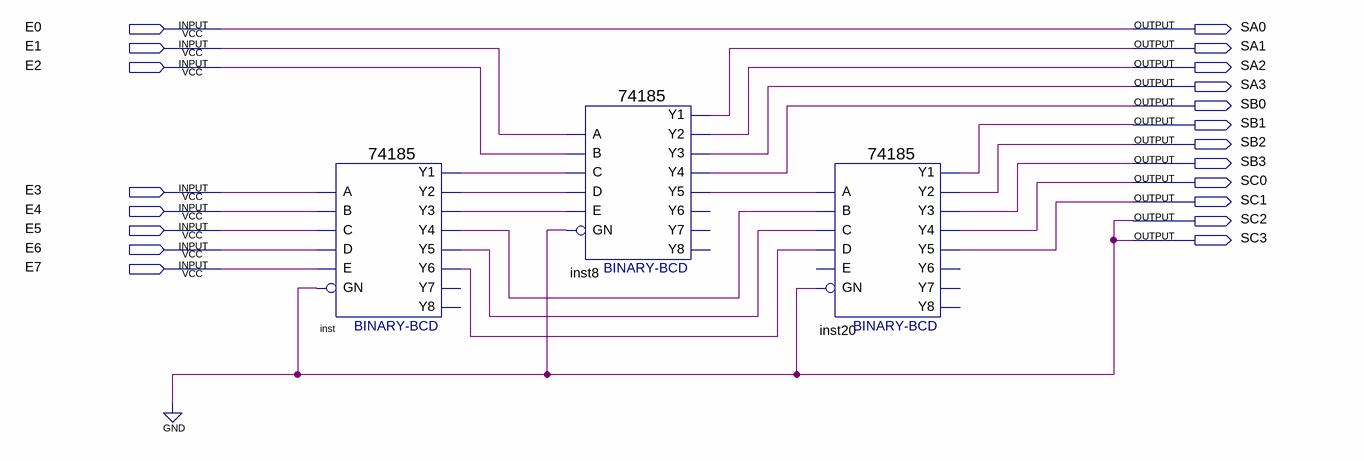
[diagram p0: schematic sheet]
// Quartus schematic figura2.bdf as structural Verilog: 3 symbols, 20 pins
module figura2 (
  input  E0,
  input  E1,
  input  E2,
  input  E3,
  input  E4,
  input  E5,
  input  E6,
  input  E7,
  output SA0,
  output SA1,
  output SA2,
  output SA3,
  output SB0,
  output SB1,
  output SB2,
  output SB3,
  output SC0,
  output SC1,
  output SC2,
  output SC3
);

  wire inst8_y5, inst_y1, inst_y2, inst_y3, inst_y4, inst_y5, inst_y6;

  \74185  inst (
    .A(E3), .B(E4), .D(E6), .C(E5), .E(E7), .GN(1'b0), .Y1(inst_y1), .Y3(inst_y3), .Y2(inst_y2),
    .Y5(inst_y5), .Y4(inst_y4), .Y6(inst_y6));  // open: Y8, Y7
  \74185  inst8 (
    .A(E1), .B(E2), .D(inst_y2), .C(inst_y1), .E(inst_y3), .GN(1'b0), .Y1(SA1), .Y3(SA3), .Y2(SA2),
    .Y5(inst8_y5), .Y4(SB0));  // open: Y6, Y8, Y7
  \74185  inst20 (
    .A(inst8_y5), .B(inst_y4), .D(inst_y6), .C(inst_y5), .GN(1'b0), .Y1(SB1), .Y3(SB3), .Y2(SB2), .Y5(SC1),
    .Y4(SC0));  // open: E, Y6, Y8, Y7

  assign SA0 = E0;
  assign SC2 = 1'b0;
  assign SC3 = 1'b0;
endmodule
